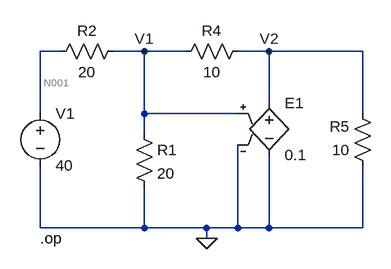
[diagram p0: schematic dependent_source_4.asc]
dependent_source_4.asc, the LTspice schematic file:
Version 4
SHEET 1 880 680
WIRE -48 32 -80 32
WIRE 80 32 32 32
WIRE 144 32 80 32
WIRE 272 32 224 32
WIRE 416 32 272 32
WIRE 272 112 272 32
WIRE -80 128 -80 32
WIRE 80 128 80 32
WIRE 224 128 80 128
WIRE 416 128 416 32
WIRE 80 160 80 128
WIRE -80 304 -80 208
WIRE 80 304 80 240
WIRE 80 304 -80 304
WIRE 176 304 80 304
WIRE 224 304 224 176
WIRE 224 304 176 304
WIRE 272 304 272 192
WIRE 272 304 224 304
WIRE 416 304 416 208
WIRE 416 304 272 304
WIRE 176 320 176 304
FLAG 176 320 0
FLAG 80 32 V1
FLAG 272 32 V2
SYMBOL res 64 144 R0
SYMATTR InstName R1
SYMATTR Value 20
SYMBOL res -64 48 R270
WINDOW 0 32 56 VTop 2
WINDOW 3 0 56 VBottom 2
SYMATTR InstName R2
SYMATTR Value 20
SYMBOL res 128 48 R270
WINDOW 0 32 56 VTop 2
WINDOW 3 0 56 VBottom 2
SYMATTR InstName R4
SYMATTR Value 10
SYMBOL res 432 224 R180
WINDOW 0 36 76 Left 2
WINDOW 3 36 40 Left 2
SYMATTR InstName R5
SYMATTR Value 10
SYMBOL voltage -80 112 R0
SYMATTR InstName V1
SYMATTR Value 40
SYMBOL e 272 96 R0
SYMATTR InstName E1
SYMATTR Value 0.1
TEXT -80 320 Left 2 !.op

The netlist it stands for:
* dependent_source_4.asc
R1 V1 0 20
R2 N001 V1 20
R4 V1 V2 10
R5 0 V2 10
V1 N001 0 40
E1 V2 0 V1 0 0.1
.op
.backanno
.end

* Results of the author's LTspice run, read from the files saved beside the schematic
* Operating Point:
*   V(v1) = 10.53 V
*   V(n001) = 40 V
*   V(v2) = 1.053 V
*   I(R5) = -105.3 mA
*   I(R4) = 947.4 mA
*   I(R2) = 1.474 A
*   I(R1) = 526.3 mA
*   I(E1) = 842.1 mA
*   I(V1) = -1.474 A